# Altium schematic sheet OCU_r3.SchDoc
size A4
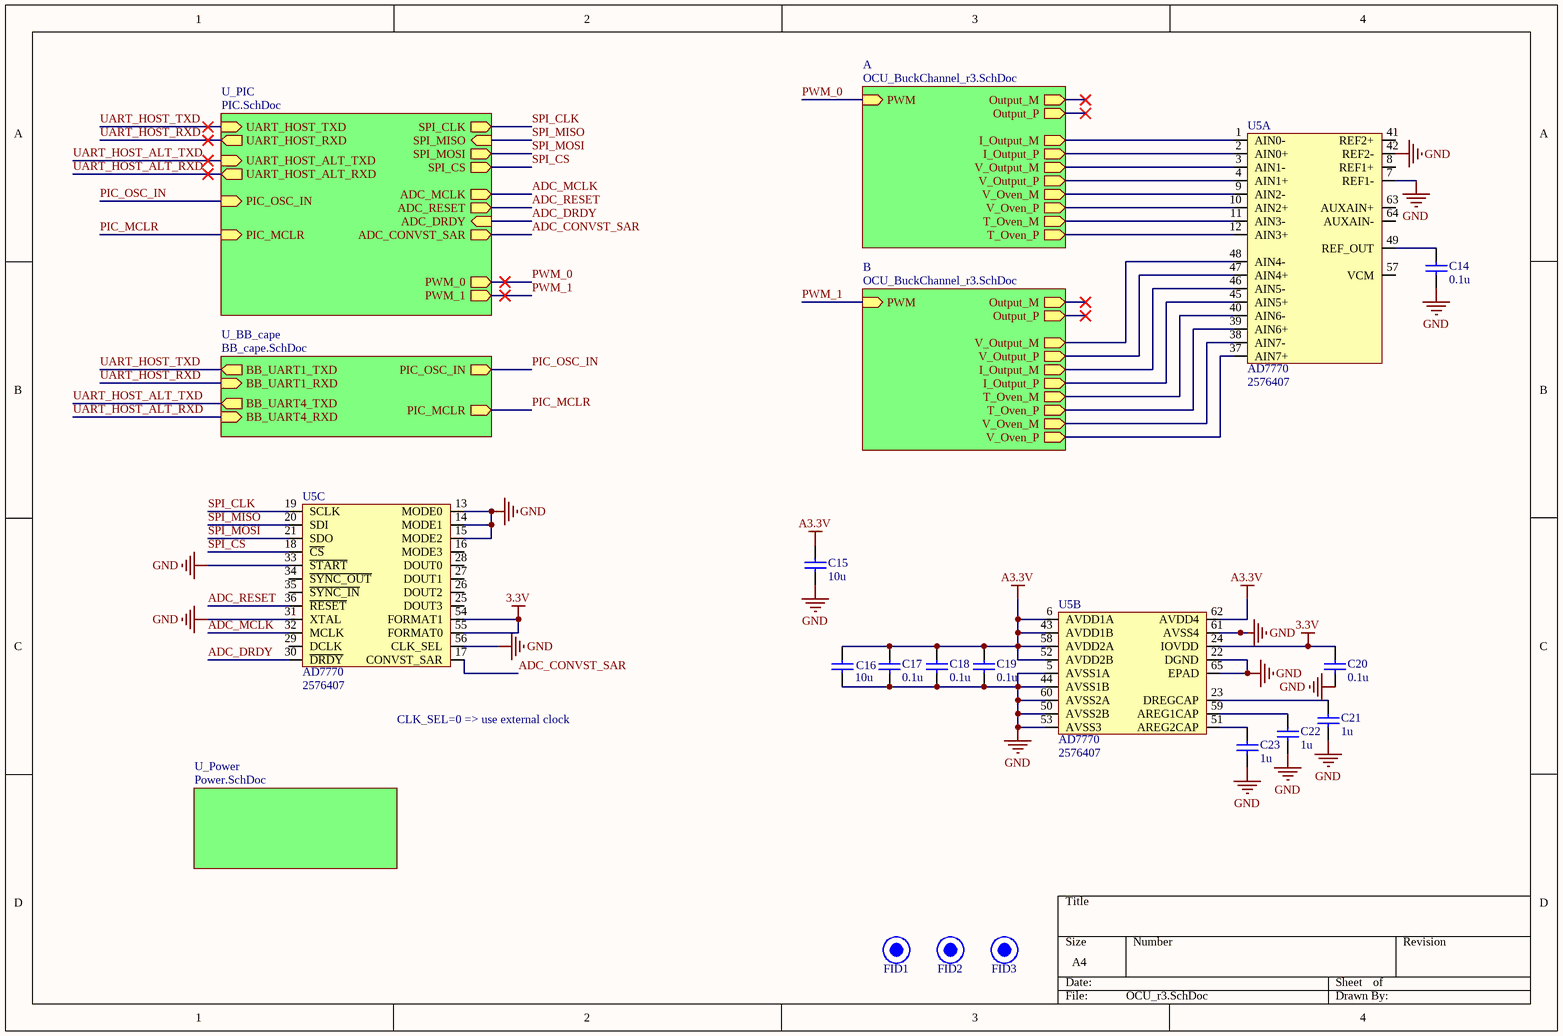
[diagram p0: OCU_r3.SchDoc]

## Parts
C14  0.1u  [CAPC1608M]
C15  10u  [CAPC2012M]
C16  10u  [CAPC2012M]
C17  0.1u  [CAPC1608M]
C18  0.1u  [CAPC1608M]
C19  0.1u  [CAPC1608M]
C20  0.1u  [CAPC1608M]
C21  1u  [CAPC1608M]
C22  1u  [CAPC1608M]
C23  1u  [CAPC1608M]
FID1  fiducial  [FIDUCIAL]  (value not drawn)  (no BOM)
FID2  fiducial  [FIDUCIAL]  (value not drawn)  (no BOM)
FID3  fiducial  [FIDUCIAL]  (value not drawn)  (no BOM)
U5  AD7770  Supplier Part Number 1: 2576407  [CP-64-15_M]  (parts A,B,C of 3)

## Sub-sheets
A = OCU_BuckChannel_r3.SchDoc: PWM (in), Output_P (out), Output_M (out), I_Output_P (out), T_Oven_P (out), T_Oven_M (out), I_Output_M (out), V_Output_P (out), V_Output_M (out), V_Oven_P (out), V_Oven_M (out)
B = OCU_BuckChannel_r3.SchDoc: PWM (in), Output_P (out), Output_M (out), I_Output_P (out), T_Oven_P (out), T_Oven_M (out), I_Output_M (out), V_Output_P (out), V_Output_M (out), V_Oven_P (out), V_Oven_M (out)
U_BB_cape = BB_cape.SchDoc: BB_UART1_TXD (out), BB_UART1_RXD (in), PIC_OSC_IN (out), PIC_MCLR (out), BB_UART4_TXD (out), BB_UART4_RXD (in)
U_PIC = PIC.SchDoc: UART_HOST_TXD (in), UART_HOST_RXD (out), PIC_OSC_IN (in), SPI_CLK (out), SPI_MOSI (out), SPI_MISO (in), ADC_MCLK (out), SPI_CS (out), ADC_CONVST_SAR (out), ADC_RESET (out), ADC_DRDY (in), PWM_0 (out), PWM_1 (out), PIC_MCLR (in), UART_HOST_ALT_TXD (in), UART_HOST_ALT_RXD (out)
U_Power = Power.SchDoc: no entries

## Nets
3.3V: C20.1 U5.24(IOVDD) U5.54(FORMAT1) U5.55(FORMAT0)
A3.3V: C15.2 C16.2 C17.1 C18.1 C19.1 U5.6(AVDD1A) U5.43(AVDD1B) U5.52(AVDD2B) U5.58(AVDD2A) U5.62(AVDD4)
GND: C14.2 C15.1 C16.1 C17.2 C18.2 C19.2 C20.2 C21.2 C22.2 C23.2 U5.5(AVSS1A) U5.7(REF1-) U5.13(MODE0) U5.14(MODE1) U5.15(MODE2) U5.22(DGND) U5.31(XTAL) U5.33(~{START}) U5.42(REF2-) U5.44(AVSS1B) U5.50(AVSS2B) U5.53(AVSS3) U5.56(CLK_SEL) U5.60(AVSS2A) U5.61(AVSS4) U5.65(EPAD)
ADC_CONVST_SAR: U5.17(CONVST_SAR) ; sheet U_PIC/ADC_CONVST_SAR
ADC_DRDY: U5.30(~{DRDY}) ; sheet U_PIC/ADC_DRDY
ADC_MCLK: U5.32(MCLK) ; sheet U_PIC/ADC_MCLK
ADC_RESET: U5.36(~{RESET}) ; sheet U_PIC/ADC_RESET
PIC_MCLR: sheet U_PIC/PIC_MCLR, sheet U_BB_cape/PIC_MCLR
PIC_OSC_IN: sheet U_PIC/PIC_OSC_IN, sheet U_BB_cape/PIC_OSC_IN
PWM_0: sheet A/PWM, sheet U_PIC/PWM_0
PWM_1: sheet B/PWM, sheet U_PIC/PWM_1
SPI_CLK: U5.19(SCLK) ; sheet U_PIC/SPI_CLK
SPI_CS: U5.18(~{CS}) ; sheet U_PIC/SPI_CS
SPI_MISO: U5.20(SDI) ; sheet U_PIC/SPI_MISO
SPI_MOSI: U5.21(SDO) ; sheet U_PIC/SPI_MOSI
UART_HOST_ALT_RXD: sheet U_PIC/UART_HOST_ALT_RXD, sheet U_BB_cape/BB_UART4_RXD
UART_HOST_ALT_TXD: sheet U_PIC/UART_HOST_ALT_TXD, sheet U_BB_cape/BB_UART4_TXD
UART_HOST_RXD: sheet U_PIC/UART_HOST_RXD, sheet U_BB_cape/BB_UART1_RXD
UART_HOST_TXD: sheet U_PIC/UART_HOST_TXD, sheet U_BB_cape/BB_UART1_TXD
NetC14_1: C14.1 U5.49(REF_OUT)
NetC21_1: C21.1 U5.23(DREGCAP)
NetC22_1: C22.1 U5.59(AREG1CAP)
NetC23_1: C23.1 U5.51(AREG2CAP)
NetU5_1: U5.1(AIN0-) ; sheet A/I_Output_M
NetU5_2: U5.2(AIN0+) ; sheet A/I_Output_P
NetU5_3: U5.3(AIN1-) ; sheet A/V_Output_M
NetU5_4: U5.4(AIN1+) ; sheet A/V_Output_P
NetU5_9: U5.9(AIN2-) ; sheet A/V_Oven_M
NetU5_10: U5.10(AIN2+) ; sheet A/V_Oven_P
NetU5_11: U5.11(AIN3-) ; sheet A/T_Oven_M
NetU5_12: U5.12(AIN3+) ; sheet A/T_Oven_P
NetU5_37: U5.37(AIN7+) ; sheet B/V_Oven_P
NetU5_38: U5.38(AIN7-) ; sheet B/V_Oven_M
NetU5_39: U5.39(AIN6+) ; sheet B/T_Oven_P
NetU5_40: U5.40(AIN6-) ; sheet B/T_Oven_M
NetU5_45: U5.45(AIN5+) ; sheet B/I_Output_P
NetU5_46: U5.46(AIN5-) ; sheet B/I_Output_M
NetU5_47: U5.47(AIN4+) ; sheet B/V_Output_P
NetU5_48: U5.48(AIN4-) ; sheet B/V_Output_M

Not connected (* = marked no-connect by the designer): U5 8(REF1+) 16(MODE3) 25(DOUT3) 26(DOUT2) 27(DOUT1) 28(DOUT0) 29(DCLK) 34(~{SYNC_OUT}) 35(~{SYNC_IN}) 41(REF2+) 57(VCM) 63(AUXAIN+) 64(AUXAIN-)

## Notes on the sheet
- CLK_SEL=0 => use external clock

## Library data of the parts
C14-C23 = C
  C14 C17-C20: Value: 0.1u
  C15 C16: Value: 10u
  C21-C23: Value: 1u
FID1-FID3 = fiducial: fiducial, 1mm diameter
U5 = AD7770: 8-channel 24-bit ADC; Supplier 1: Farnell